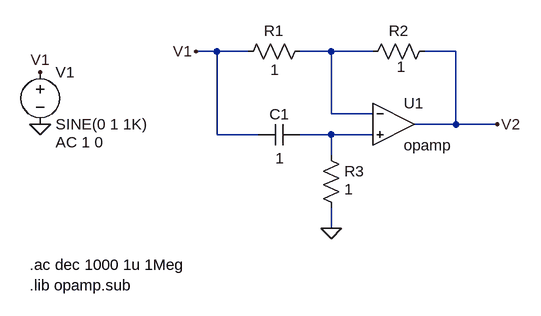
[diagram p0: schematic ejercicio_normalizado.asc]
ejercicio_normalizado.asc, the LTspice schematic file:
Version 4.1
SHEET 1 880 680
WIRE 288 -16 256 -16
WIRE 336 -16 288 -16
WIRE 464 -16 416 -16
WIRE 528 -16 464 -16
WIRE 656 -16 608 -16
WIRE 464 80 464 -16
WIRE 528 80 464 80
WIRE 656 96 656 -16
WIRE 656 96 592 96
WIRE 720 96 656 96
WIRE 288 112 288 -16
WIRE 352 112 288 112
WIRE 464 112 416 112
WIRE 528 112 464 112
WIRE 464 144 464 112
WIRE 464 256 464 224
FLAG 720 96 V2
FLAG 256 -16 V1
FLAG 16 96 0
FLAG 16 16 V1
FLAG 464 256 0
SYMBOL res 432 -32 R90
WINDOW 0 0 56 VBottom 2
WINDOW 3 60 55 VBottom 2
SYMATTR InstName R1
SYMATTR Value 1
SYMBOL res 624 -32 R90
WINDOW 0 0 56 VBottom 2
WINDOW 3 55 52 VBottom 2
SYMATTR InstName R2
SYMATTR Value 1
SYMBOL res 448 128 R0
WINDOW 3 36 68 Left 2
SYMATTR Value 1
SYMATTR InstName R3
SYMBOL OpAmps\\opamp 560 32 R0
SYMATTR InstName U1
SYMBOL cap 416 96 R90
WINDOW 0 0 32 VBottom 2
WINDOW 3 68 31 VBottom 2
SYMATTR InstName C1
SYMATTR Value 1
SYMBOL voltage 16 0 R0
WINDOW 123 24 124 Left 2
WINDOW 39 0 0 Left 0
SYMATTR Value2 AC 1 0
SYMATTR InstName V1
SYMATTR Value SINE(0 1 1K)
TEXT 0 344 Left 2 !.lib opamp.sub
TEXT 0 312 Left 2 !.ac dec 1000 1u 1Meg

The netlist it stands for:
* ejercicio_normalizado.asc
R1 N001 V1 1
R2 V2 N001 1
R3 N002 0 1
X§U1 N001 N002 V2 opamp Aol=100K GBW=10Meg  ; pins invin noninvin out
C1 N002 V1 1
V1 V1 0 SINE(0 1 1K) AC 1 0
.lib opamp.sub
.ac dec 1000 1u 1Meg
.backanno
.end